# Altium schematic sheet TesteRJ45.SchDoc
size A4
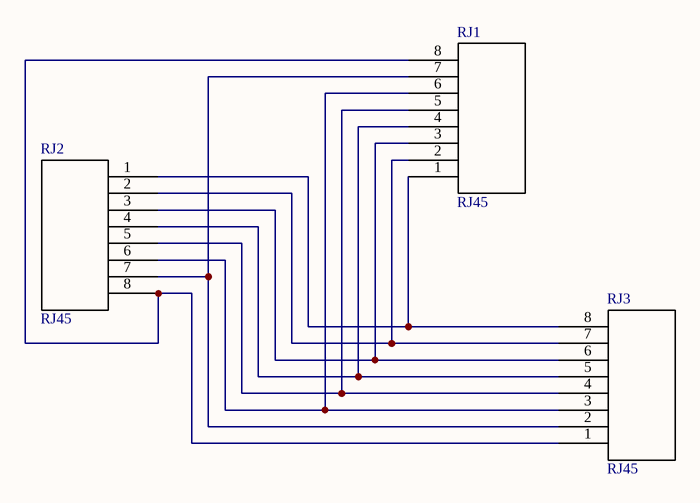
[diagram p0: TesteRJ45.SchDoc]

## Parts
RJ1  RJ45  [RJ45_Simples]
RJ2  RJ45  [RJ45_Simples]
RJ3  RJ45  [RJ45_Simples]

## Nets
NetRJ1_1: RJ1.1 RJ2.1 RJ3.8
NetRJ1_2: RJ1.2 RJ2.2 RJ3.7
NetRJ1_3: RJ1.3 RJ2.3 RJ3.6
NetRJ1_4: RJ1.4 RJ2.4 RJ3.5
NetRJ1_5: RJ1.5 RJ2.5 RJ3.4
NetRJ1_6: RJ1.6 RJ2.6 RJ3.3
NetRJ1_7: RJ1.7 RJ2.7 RJ3.2
NetRJ1_8: RJ1.8 RJ2.8 RJ3.1